# Altium schematic sheet Monitor Blanking V3.SchDoc
size 297 x 209 mm; CompanyName: Sainsbury Wellcome Centre; Organization: FabLab; Address1: Sainsbury Wellcome Centre; Address2: 25 Howland Street; Address3: London; Address4: W1T 4JG; DocumentNumber: 1; SheetNumber: 1; SheetTotal: 3; swcgroup: FabLab; Org: Sainsbury Wellcome Centre; Add1: 25 Howland Street; Add2: London; Add3: W1T 4JG; WebAddress: www.sainsburywellcome.org; SheetSize: A4
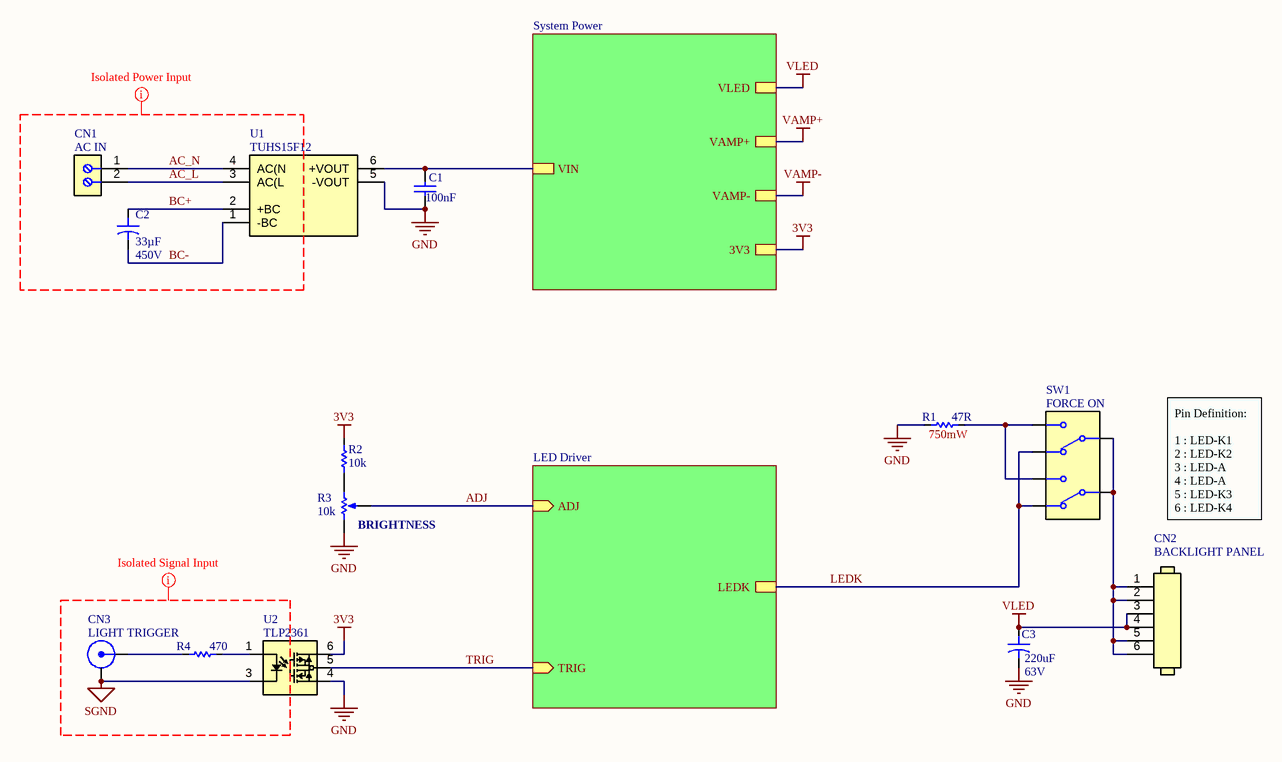
[diagram p0: Monitor Blanking V3.SchDoc]

## Parts
C1  value 100nF  [CAP_CHIP_0603]  (hidden comment: C0603-100nF-50V)
C2  value 33µF  Voltage Rating: 450V  [ECAP_DIP_12.5_90]  (hidden comment: EC125-33uF-450V)
C3  value 220uF  Voltage Rating: 63V  [ECAP_SMD_D12.5_13.5L]  (hidden comment: EC125-220uF-63V)
CN1  AC IN  [BT-8.26-1X2P]
CN2  BACKLIGHT PANEL  [PH_DIP_90_1X6P]
CN3  LIGHT TRIGGER  [BNC-TE-5227222]
R1  value 47R  Power Rating: 750mW  [RES_CHIP_2010]  (hidden comment: R2010-47R)
R2  value 10k  [RES_CHIP_0603]  (hidden comment: R0603-10K)
R3  BRIGHTNESS  value 10k  [RK09L1140]
R4  value 470  [RES_CHIP_0603]  (hidden comment: R0603-470R)
SW1  FORCE ON  [SW_LOCK_SPPH410100]
U1  TUHS15F12  [TUHS15F12]
U2  TLP2361  [SO5]

## Sub-sheets
LED Driver = LED Driver.SchDoc: TRIG (in), LEDK, ADJ (in)
System Power = System Power.SchDoc: VIN, VAMP+, 3V3, VAMP-, VLED

## Nets
3V3: R2.2 U2.6(VCC) ; sheet System Power/3V3
GND: C1.1 C3.2 R1.1 R3.1(TOP) U1.5(-VOUT) U2.4(GND)
SGND: CN3.2(GND) U2.3(Cathode)
VAMP+: sheet System Power/VAMP+
VAMP-: sheet System Power/VAMP-
VLED: C3.1 CN2.3 CN2.4 ; sheet System Power/VLED
AC_L: CN1.2 U1.3(AC(L)
AC_N: CN1.1 U1.4(AC(N)
ADJ: R3.2(TAP) ; sheet LED Driver/ADJ
BC+: C2.1 U1.2(+BC)
BC-: C2.2 U1.1(-BC)
LEDK: SW1.1(NCA) SW1.4(NCB) ; sheet LED Driver/LEDK
TRIG: U2.5(Vo) ; sheet LED Driver/TRIG
NetC1_2: C1.2 U1.6(+VOUT) ; sheet System Power/VIN
NetCN2_1: CN2.1(d) CN2.2 CN2.5 CN2.6 SW1.2(COMA) SW1.5(COMB)
NetCN3_1: CN3.1(SIG) R4.1
NetR1_2: R1.2 SW1.3(NOA) SW1.6(NOB)
NetR2_1: R2.1 R3.3(BOT)
NetR4_2: R4.2 U2.1(Anode)

## Layout directives
mark named Isolated Signal Input: SGND
mark named Isolated Power Input: AC_L, AC_N, BC+, BC-

## Notes on the sheet
- Pin Definition:
  1 : LED-K1
  2 : LED-K2
  3 : LED-A
  4 : LED-A
  5 : LED-K3
  6 : LED-K4
- FILE
- VARIANT
- DATE
- REVISION
- SHEET
- /
- PROJECT
- SIZE

## Library data of the parts
C1 = CMP-611-0027-24: 0603 Multilayer Ceramic Capacitors MLCC; PartNumber: CC0603KRX7R9BB104; Tolerance: 10%; Pick&PlaceFootprint: C0603; Dielectric: X7R; Voltage Rating: 50V; Capacitor Type: Ceramic; RoHS: Yes; Mount: SMD; LCSC Part N.: C14663; Case/Package: 0603
C2 = CMP-612-0013-1: Aluminum Electrolytic Capacitor, Polarized, Aluminum (wet), 450V, 20% +Tol, 20% -Tol, 33uF, Through Hole Mount; PartNumber: 450BXW33MEFR12.5X25; Capacitor Type: Aluminium; Tolerance: 20%; LCSC Part N.: C1589601; Mount: TH
C3 = CMP-612-0011-1: Radial Can - SMD ALUMINUM ELECTROLYTIC CAPACITOR FK 63V 220muF 20% 0.492Dia 12.50mm; PartNumber: EEEFK1J221AQ; Ripple Current: 800mA; ESR (Equivalent Series Resistance): 160mR; LCSC Part N.: C215762; Capacitor Type: Electrolytic; Tolerance: 20%
CN1 = CMP-330-0001-1: CONN BARRIER STRIP 2CIRC 0.325"; PartNumber: 4DB-P108-02; Gender: Male; Max Current Rating: 10A; Number of Positions: 2; Voltage Rating: 300V; Current Rating: 20A; Pitch: 8.26mm; Orientation: Straight; LCSC Part N.: C5902324; Number of Contacts: 2; Number of Rows: 1
CN2 = CMP-370-0048-1: Wire-To-Board Connector, Right Angle, 2 mm, 2 Contacts, Header, PH Series; PartNumber: X2016WR-06-46SN; Gender: Male; Max Voltage Rating (DC): 100V; Max Current Rating: 2A; Orientation: Right Angle; Mount: Through; LCSC Part N.: C696999; Lead Pitch: 2mm
CN3 = CMP-730-0010-3: RF BNC Connector, Female, Panel Mount, Board Mount, Solder Terminal, Jack; PartNumber: 5227222-3; Connector Type: BNC,Jack; Clock Frequency: 4GHz; Characteristic Impedance: 50R; Gender: Female; LCSC Part N.: C3175614; Orientation: Straight; Contact Material: Bronze; Mount: Surface Mount
R1 = CMP-633-0165-2: Res Thick Film 2010 47 Ohm 1% 3/4W ±100ppm/°C Molded SMD SMD Embossed T/R; PartNumber: RC2010FK-0747RL; Pick&PlaceFootprint: 2010; Number of Resistors: 1; Voltage Rating: 200V; LCSC Part N.: C877463; Tolerance: 1%; Mount: Surface Mount
R2 = CMP-633-0002-26: 100mW Thick Film Resistors 75V ±100ppm/℃ ±1% 0603 Chip Resistor; PartNumber: 0603WAF1002T5E; Number of Resistors: 1; Pick&PlaceFootprint: R0603; Case/Package: 0603; Voltage Rating: 75V; Power Rating: 100mW; LCSC Part N.: C25804; Tolerance: 1%; Mount: Surface Mount
R3 = CMP-632-0008-2: Potentiometer, 0.05W, 10000ohm, 10V, 20% +/-Tol, 1 Turn(s), 4845; PartNumber: RK09L114001T; Power Rating: 50mW; Number of Turns: 1; Tolerance: 20%; LCSC Part N.: C470463; Type: Potentiometer; Case/Package: 4845; RoHS: Yes; Mount: TH
R4 = CMP-633-0020-24: 100mW Thick Film Resistors 75V ±100ppm/℃ ±1% 0603 Chip Resistor; PartNumber: 0603WAF4700T5E; Pick&PlaceFootprint: R0603; Number of Resistors: 1; Voltage Rating: 75V; Power Rating: 100mW; LCSC Part N.: C23179; Case/Package: 0603; Tolerance: 1%; Mount: Surface Mount
SW1 = CMP-B00-0031-1: Switch Push Button N.O./N.C. DPDT Plunger 0.1A 30VDC Latching PC Pins Thru-Hole Bulk; PartNumber: SPPH410100; Voltage Rating (DC): 30V; Operating Force: 2N; Current Rating: 100mA; Contact Resistance: 100mR; Throw Configuration: DPDT; LCSC Part N.: C370973; Type: Latching
U1 = CMP-A10-0017-1: AC/DC 15W 12V Single Output Power Supply, Encapsulated Board Mount Module; Max Output current: 1.25A; Efficiency: 85%; Number of Outputs: 1; PartNumber: TUHS15F12; Voltage - Output 1: 12V; Max Power Dissipation: 15W; LCSC Part N.: C3031238
U2 = CMP-530-0005-1: Logic IC Output Optocoupler, 1-Channel, 1-Element, 3750V Isolation, 20MBps; PartNumber: TLP2361(TPL,E(T; Forward Voltage: 1.5V; Propagation Delay: 80ns; Direction: Unidirectional; Fall Time: 3ns; Forward Current: 10mA; LCSC Part N.: C107626; Output Current per Channel: 10mA